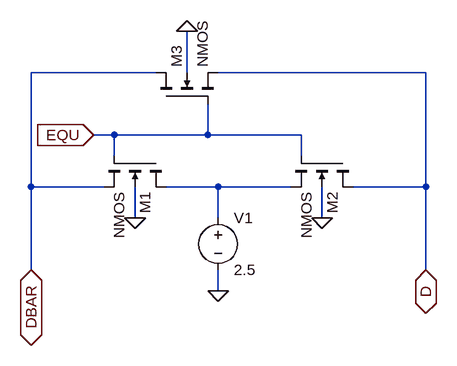
[diagram p0: schematic EquilibBias.asc]
EquilibBias.asc, the LTspice schematic file:
Version 4
SHEET 1 880 680
WIRE -80 -48 -272 -48
WIRE -32 -48 -32 -112
WIRE 336 -48 16 -48
WIRE -144 48 -176 48
WIRE 0 48 0 0
WIRE 0 48 -144 48
WIRE 144 48 0 48
WIRE -144 80 -144 48
WIRE 144 80 144 48
WIRE -272 128 -272 -48
WIRE -160 128 -272 128
WIRE 16 128 -64 128
WIRE 128 128 16 128
WIRE 336 128 336 -48
WIRE 336 128 224 128
WIRE -112 176 -112 128
WIRE 16 176 16 128
WIRE 176 176 176 128
WIRE -272 256 -272 128
WIRE 336 256 336 128
WIRE 16 288 16 256
FLAG -272 256 DBAR
IOPIN -272 256 BiDir
FLAG 336 256 D
IOPIN 336 256 BiDir
FLAG -176 48 EQU
IOPIN -176 48 In
FLAG 16 288 0
FLAG -32 -112 0
FLAG -112 176 0
FLAG 176 176 0
SYMBOL nmos4 -64 80 R90
SYMATTR InstName M1
SYMATTR Value2 l=0.6u w=3u
SYMBOL nmos4 224 80 R90
SYMATTR InstName M2
SYMATTR Value2 l=0.6u w=3u
SYMBOL nmos4 -80 0 R270
SYMATTR InstName M3
SYMATTR Value2 l=0.6u w=3u
SYMBOL voltage 16 160 R0
WINDOW 123 0 0 Left 0
WINDOW 39 0 0 Left 0
SYMATTR InstName V1
SYMATTR Value 2.5

The netlist it stands for:
* EquilibBias.asc
M1 N001 EQU DBAR 0 NMOS l=0.6u w=3u
M2 D EQU N001 0 NMOS l=0.6u w=3u
M3 DBAR EQU D 0 NMOS l=0.6u w=3u
V1 N001 0 2.5
.model NMOS NMOS
.model PMOS PMOS
.lib standard.mos
.backanno
.end